# EAGLE design electron_layout_2 (EAGLE 8.5.1)

## Sheet 1 of 3
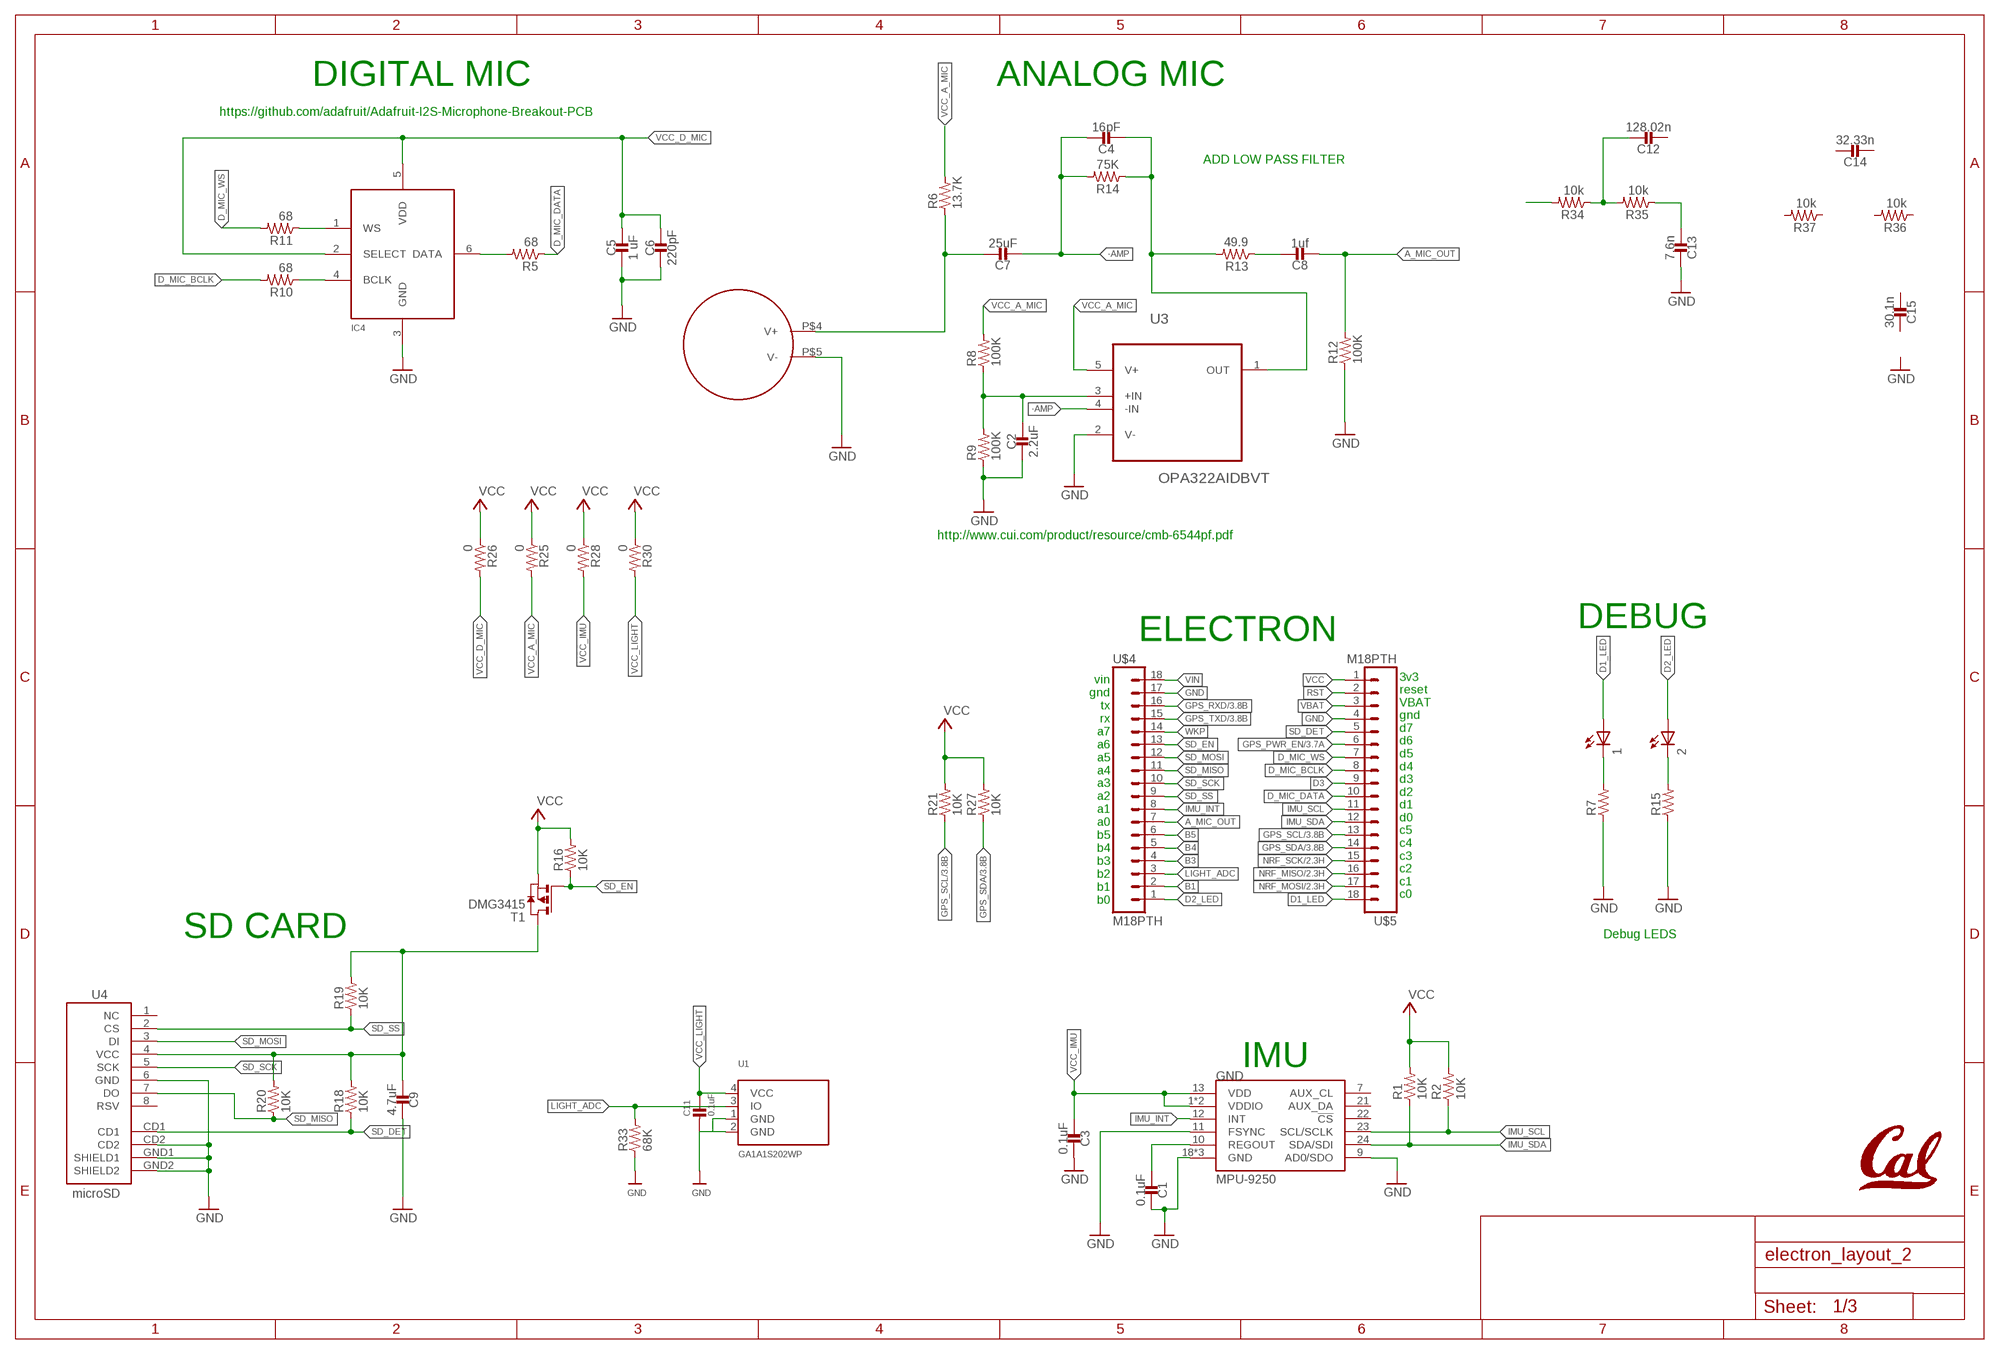
[diagram p0: schematic, sheet 1]

### Parts
1  LEDCHIP-LED0603  [CHIP-LED0603]
2  LEDCHIP-LED0603  [CHIP-LED0603]
C1  0.1uF  CAPACITOR0402_CAP  [0402_CAP]
C2  2.2uF  CAPACITOR0402_CAP  [0402_CAP]
C3  0.1uF  CAPACITOR0402_CAP  [0402_CAP]
C4  16pF  CAPACITOR0402_CAP  [0402_CAP]
C5  1 uF  CAPACITOR0402_CAP  [0402_CAP]
C6  220pF  CAPACITOR0402_CAP  [0402_CAP]
C7  25uF  CAPACITOR0402_CAP  [0402_CAP]
C8  1uf  CAPACITOR0402_CAP  [0402_CAP]
C9  4.7uF  CAPACITOR0402_CAP  [0402_CAP]
C11  0.1uF  CAP_CERAMIC_0805MP  [_0805MP]
C12  128.02n  CAPACITOR0402_CAP  [0402_CAP]
C13  7.6n  CAPACITOR0402_CAP  [0402_CAP]
C14  32.33n  CAPACITOR0402_CAP  [0402_CAP]
C15  30.1n  CAPACITOR0402_CAP  [0402_CAP]
GND  MPU-9250  [QFN24_PAD]
IC4  MIC_I2S_SPH0645  [SPH0645LM4H]
L1  UCB_CAL100MIL  [UCB_CAL_100MIL]
R1  10K  RESISTOR0402_RES  [0402_RES]
R2  10K  RESISTOR0402_RES  [0402_RES]
R5  68  RESISTOR0402_RES  [0402_RES]
R6  13.7K  RESISTOR0402_RES  [0402_RES]
R7  RESISTOR0402_RES  [0402_RES]
R8  100K  RESISTOR0402_RES  [0402_RES]
R9  100K  RESISTOR0402_RES  [0402_RES]
R10  68  RESISTOR0402_RES  [0402_RES]
R11  68  RESISTOR0402_RES  [0402_RES]
R12  100K  RESISTOR0402_RES  [0402_RES]
R13  49.9  RESISTOR0402_RES  [0402_RES]
R14  75K  RESISTOR0402_RES  [0402_RES]
R15  RESISTOR0402_RES  [0402_RES]
R16  10K  RESISTOR0402_RES  [0402_RES]
R18  10K  RESISTOR0402_RES  [0402_RES]
R19  10K  RESISTOR0402_RES  [0402_RES]
R20  10K  RESISTOR0402_RES  [0402_RES]
R21  10K  RESISTOR0402_RES  [0402_RES]
R25  0  RESISTOR0402_RES  [0402_RES]
R26  0  RESISTOR0402_RES  [0402_RES]
R27  10K  RESISTOR0402_RES  [0402_RES]
R28  0  RESISTOR0402_RES  [0402_RES]
R30  0  RESISTOR0402_RES  [0402_RES]
R33  68K  RESISTOR0402_RES  [0402_RES]
R34  10k  RESISTOR0402_RES  [0402_RES]
R35  10k  RESISTOR0402_RES  [0402_RES]
R36  10k  RESISTOR0402_RES  [0402_RES]
R37  10k  RESISTOR0402_RES  [0402_RES]
T1  DMG3415  PMOSSOT23  [SOT-23]
U1  GA1A1S202WP  [GA1A1S202WP]
U3  OPA322AIDBVT  [SOT95P280X145-5N]
U4  microSD  USD-SOCKETSMD  [MICRO-SD-SOCKET-PP]
U$1  CMB-6544PF  [CMB-6544PF]
U$4  M18PTH  [1X18-SMALL-PADS]
U$5  M18PTH  [1X18-SMALL-PADS]

### Nets
-AMP: C4.1 C7.2 R14.2 U3.4(-IN)
A_MIC_OUT: C8.2 R12.2 U$4.7
B1: U$4.2
B3: U$4.4
B4: U$4.5
B5: U$4.6
D1_LED: 1.A U$5.18
D2_LED: 2.A U$4.1
D3: U$5.9
D_MIC_BCLK: R10.2 U$5.8
D_MIC_DATA: R5.1 U$5.10
D_MIC_WS: R11.2 U$5.7
GND: C1.2 C2.2 C3.2 C5.2 C6.2 C9.2 C11.2 C13.1 GND.9(AD0/SDO) GND.11(FSYNC) GND.18(GND) GND.20(GND) GND.CENTER(GND) IC4.3(GND) R7.1 R9.1 R12.1 R15.1 R33.1 U1.1(GND) U1.2(GND) U3.2(V-) U4.6(GND) U4.CD2 U4.GND1(SHIELD1) U4.GND2(SHIELD2) U$1.P$5(V-) U$4.17 U$5.4 ; also sheet 2,3
GPS_PWR_EN: U$5.6 ; also sheet 3
GPS_RXD: U$4.16 ; also sheet 3
GPS_SCL: R21.1 U$5.13 ; also sheet 3
GPS_SDA: R27.1 U$5.14 ; also sheet 3
GPS_TXD: U$4.15 ; also sheet 3
IMU_INT: GND.12(INT) U$4.8
IMU_SCL: GND.23(SCL/SCLK) R2.1 U$5.11
IMU_SDA: GND.24(SDA/SDI) R1.1 U$5.12
LIGHT_ADC: R33.2 U1.3(IO) U$4.3
N$1: C7.1 R6.1 U$1.P$4(V+)
N$2: IC4.1(WS) R11.1
N$3: C4.2 R13.2 R14.1 U3.1(OUT)
N$4: IC4.4(BCLK) R10.1
N$5: 1.C R7.2
N$6: IC4.6(DATA) R5.2
N$7: C8.1 R13.1
N$8: 2.C R15.2
N$9: C2.1 R8.1 R9.2 U3.3(+IN)
N$10: C9.1 R18.2 R19.2 R20.2 T1.1(D) U4.4(VCC)
N$11: C12.1 R34.1 R35.2
N$12: C13.2 R35.1
N$13: R34.2
NRF_MISO: U$5.16 ; also sheet 2
NRF_MOSI: U$5.17 ; also sheet 2
NRF_SCK: U$5.15 ; also sheet 2
REGOUT: C1.1 GND.10(REGOUT)
RST: U$5.2
SD_DET: R18.1 U4.CD1 U$5.5
SD_EN: R16.1 T1.3(G) U$4.13
SD_MISO: R20.1 U4.7(DO) U$4.11
SD_MOSI: U4.3(DI) U$4.12
SD_SCK: U4.5(SCK) U$4.10
SD_SS: R19.1 U4.2(CS) U$4.9
VBAT: U$5.3
VCC: R1.2 R2.2 R21.2 R25.1 R26.1 R27.2 R28.1 R30.1 T1.2(S) U$5.1 ; also sheet 2,3
VCC_A_MIC: R6.2 R8.2 R25.2 U3.5(V+)
VCC_D_MIC: C5.1 C6.1 IC4.2(SELECT) IC4.5(VDD) R26.2
VCC_IMU: C3.1 GND.1(VDDIO) GND.8(VDDIO) GND.13(VDD) R28.2
VCC_LIGHT: C11.1 R30.2 U1.4(VCC)
VIN: U$4.18
WKP: U$4.14
Unconnected: C12.2 C14.1 C14.2 C15.1 C15.2 GND.7(AUX_CL) GND.21(AUX_DA) GND.22(!CS) R16.2 R36.1 R36.2 R37.1 R37.2 U4.1(NC) U4.8(RSV)

### Notes on the sheet
- DIGITAL MIC | ANALOG MIC
- https://github.com/adafruit/Adafruit-I2S-Microphone-Breakout-PCB
- ADD LOW PASS FILTER
- http://www.cui.com/product/resource/cmb-6544pf.pdf
- DEBUG
- ELECTRON
- vin
  gnd
  tx
  rx
  a7
  a6
  a5
  a4
  a3
  a2
  a1
  a0
  b5
  b4
  b3
  b2
  b1
  b0
- 3v3
  reset
  VBAT
  gnd
  d7
  d6
  d5
  d4
  d3
  d2
  d1
  d0
  c5
  c4
  c3
  c2
  c1
  c0
- SD CARD | Debug LEDS
- IMU

## Sheet 2 of 3: nRF51822
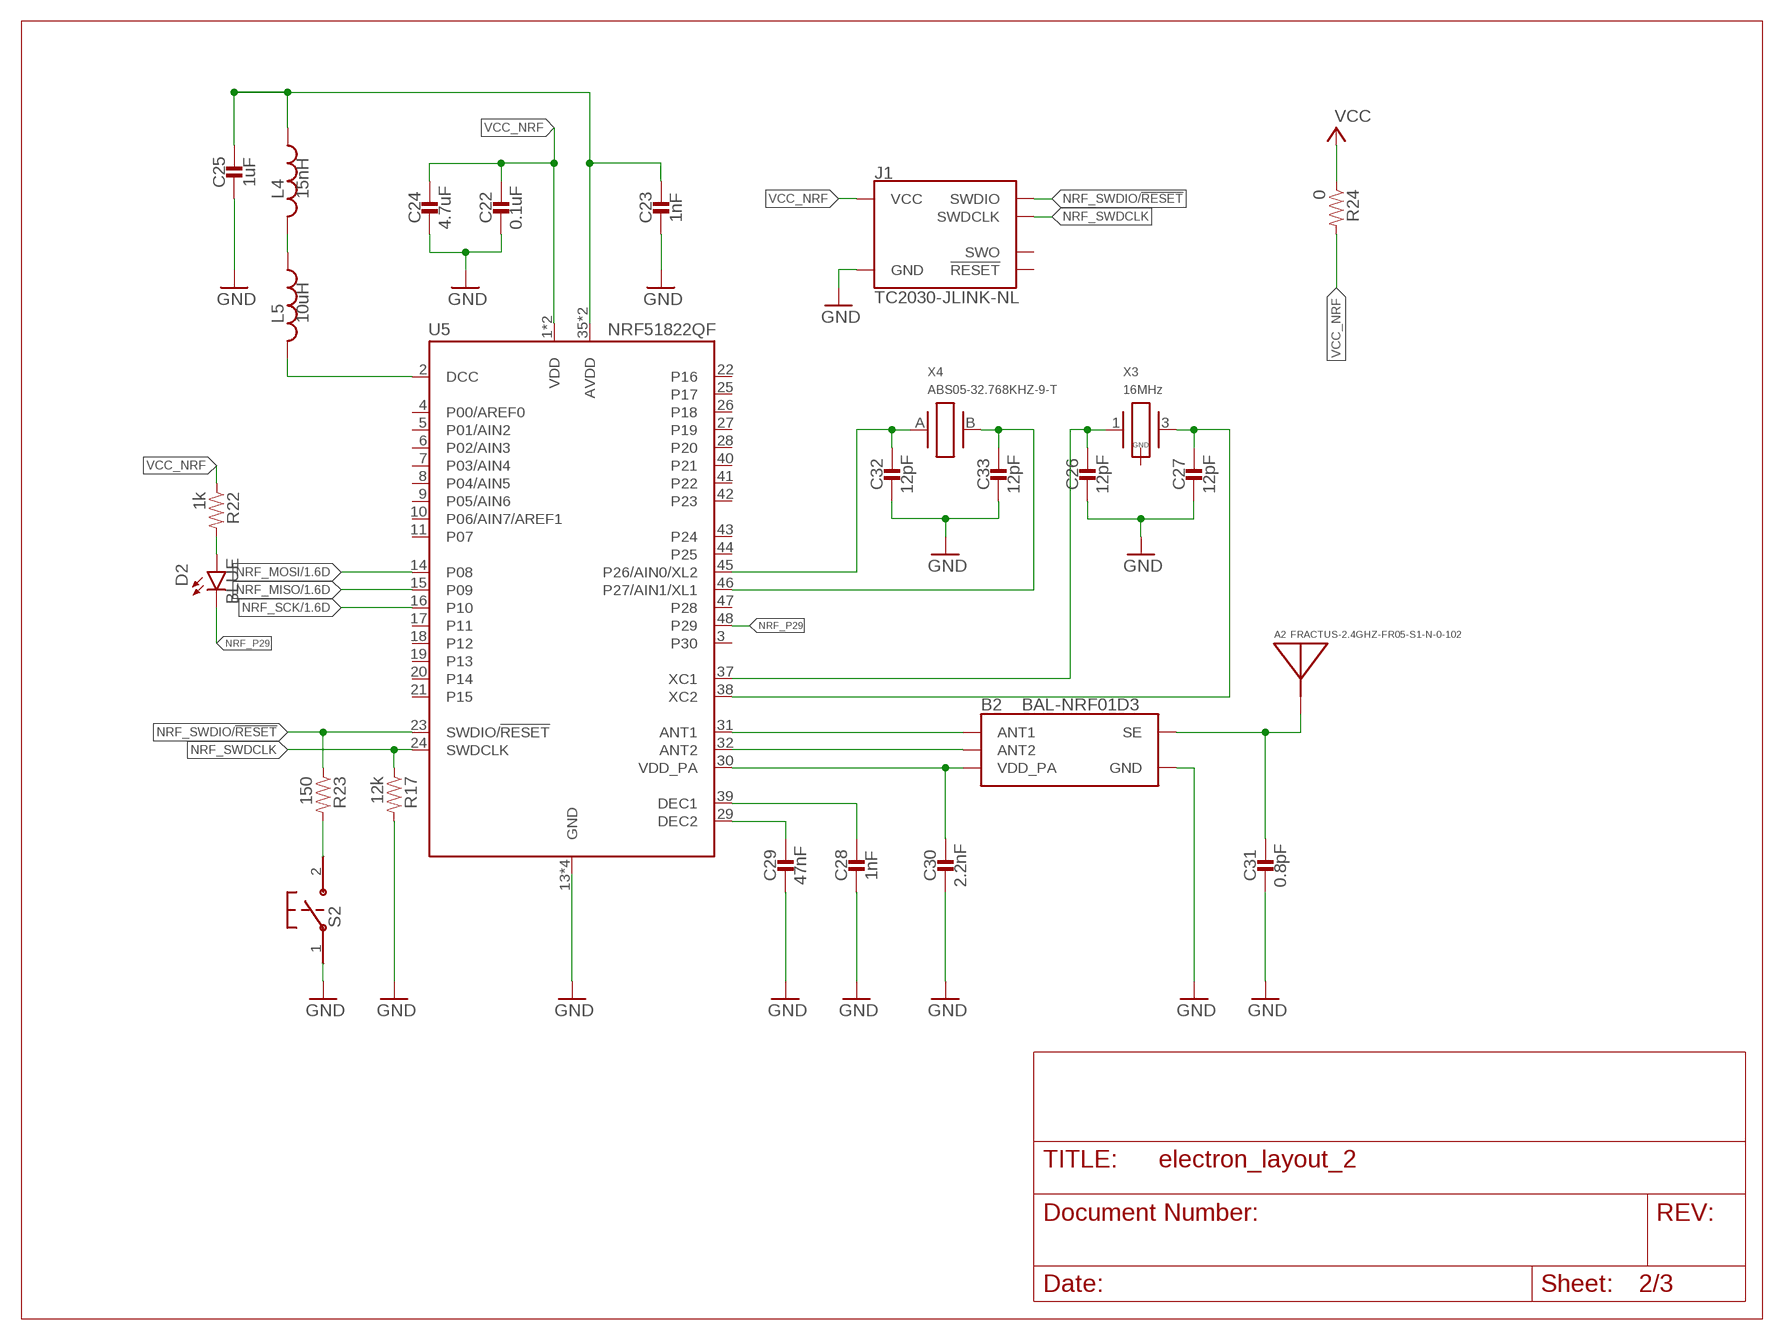
[diagram p1: schematic, sheet 2]

### Parts
A2  FRACTUS-2.4GHZ-FR05-S1-N-0-102  [FRACTUS-ANTENNA-FR05-S1-N-0-102]
B2  BAL-NRF01D3  [BAL-NRF01D3]
C22  0.1uF  CAPACITOR0402_CAP  [0402_CAP]
C23  1nF  CAPACITOR0402_CAP  [0402_CAP]
C24  4.7uF  CAPACITOR0402_CAP  [0402_CAP]
C25  1uF  CAPACITOR0402_CAP  [0402_CAP]
C26  12pF  CAPACITOR0402_CAP  [0402_CAP]
C27  12pF  CAPACITOR0402_CAP  [0402_CAP]
C28  1nF  CAPACITOR0402_CAP  [0402_CAP]
C29  47nF  CAPACITOR0402_CAP  [0402_CAP]
C30  2.2nF  CAPACITOR0402_CAP  [0402_CAP]
C31  0.8pF  CAPACITOR0402_CAP  [0402_CAP]
C32  12pF  CAPACITOR0402_CAP  [0402_CAP]
C33  12pF  CAPACITOR0402_CAP  [0402_CAP]
D2  BLUE  LED0603  [LED-0603]
J1  TC2030-JLINK-NL  [TC2030-IDC-NL]
L4  15nH  INDUCTOR0402  [0402_CAP]
L5  10uH  INDUCTOR0603  [0603_CAP]
R17  12k  RESISTOR0402_RES  [0402_RES]
R22  1k  RESISTOR0402_RES  [0402_RES]
R23  150  RESISTOR0402_RES  [0402_RES]
R24  0  RESISTOR0402_RES  [0402_RES]
S2  B3U-1000P  [B3U-1000P]
U5  NRF51822QF  [QFN-48-6MM]
X3  16MHz  TXC-8Y  [TXC-8Y]
X4  ABS05-32.768KHZ-9-T  [ABS05]

### Nets
AVDD1: C23.1 C25.1 L4.1 U5.35(AVDD) U5.36(AVDD)
DCC1: L5.2 U5.2(DCC)
GND: B2.GND C22.2 C23.2 C24.2 C25.2 C26.2 C27.2 C28.2 C29.2 C30.2 C31.2 C32.2 C33.2 J1.5(GND) R17.2 S2.1 U5.13(GND) U5.33(GND) U5.34(GND) U5.GND ; also sheet 1,3
N$24: B2.ANT1 U5.31(ANT1)
N$25: B2.ANT2 U5.32(ANT2)
N$26: A2.1(ANTENNA) B2.SE C31.1
N$27: L4.2 L5.1
N$28: C26.1 U5.37(XC1) X3.1
N$29: C27.1 U5.38(XC2) X3.3
N$30: C28.1 U5.39(DEC1)
N$31: C29.1 U5.29(DEC2)
N$32: D2.A R22.2
N$33: R23.2 S2.2
NRF_A2: C33.1 U5.46(P27/AIN1/XL1) X4.B
NRF_A3: C32.1 U5.45(P26/AIN0/XL2) X4.A
NRF_MISO: U5.15(P09) ; also sheet 1
NRF_MOSI: U5.14(P08) ; also sheet 1
NRF_P29: D2.C U5.48(P29)
NRF_SCK: U5.16(P10) ; also sheet 1
NRF_SWDCLK: J1.4(SWDCLK) R17.1 U5.24(SWDCLK)
NRF_SWDIO/!RESET: J1.2(SWDIO) R23.1 U5.23(SWDIO/!RESET)
VCC: R24.1 ; also sheet 1,3
VCC_NRF: C22.1 C24.1 J1.1(VCC) R22.1 R24.2 U5.1(VDD) U5.12(VDD)
VDD_PA1: B2.VCC(VDD_PA) C30.1 U5.30(VDD_PA)
Unconnected: J1.3(!RESET) J1.6(SWO) U5.3(P30) U5.4(P00/AREF0) U5.5(P01/AIN2) U5.6(P02/AIN3) U5.7(P03/AIN4) U5.8(P04/AIN5) U5.9(P05/AIN6) U5.10(P06/AIN7/AREF1) U5.11(P07) U5.17(P11) U5.18(P12) U5.19(P13) U5.20(P14) U5.21(P15) U5.22(P16) U5.25(P17) U5.26(P18) U5.27(P19) U5.28(P20) U5.40(P21) U5.41(P22) U5.42(P23) U5.43(P24) U5.44(P25) U5.47(P28) X3.2(GND) X3.4(GND)

## Sheet 3 of 3
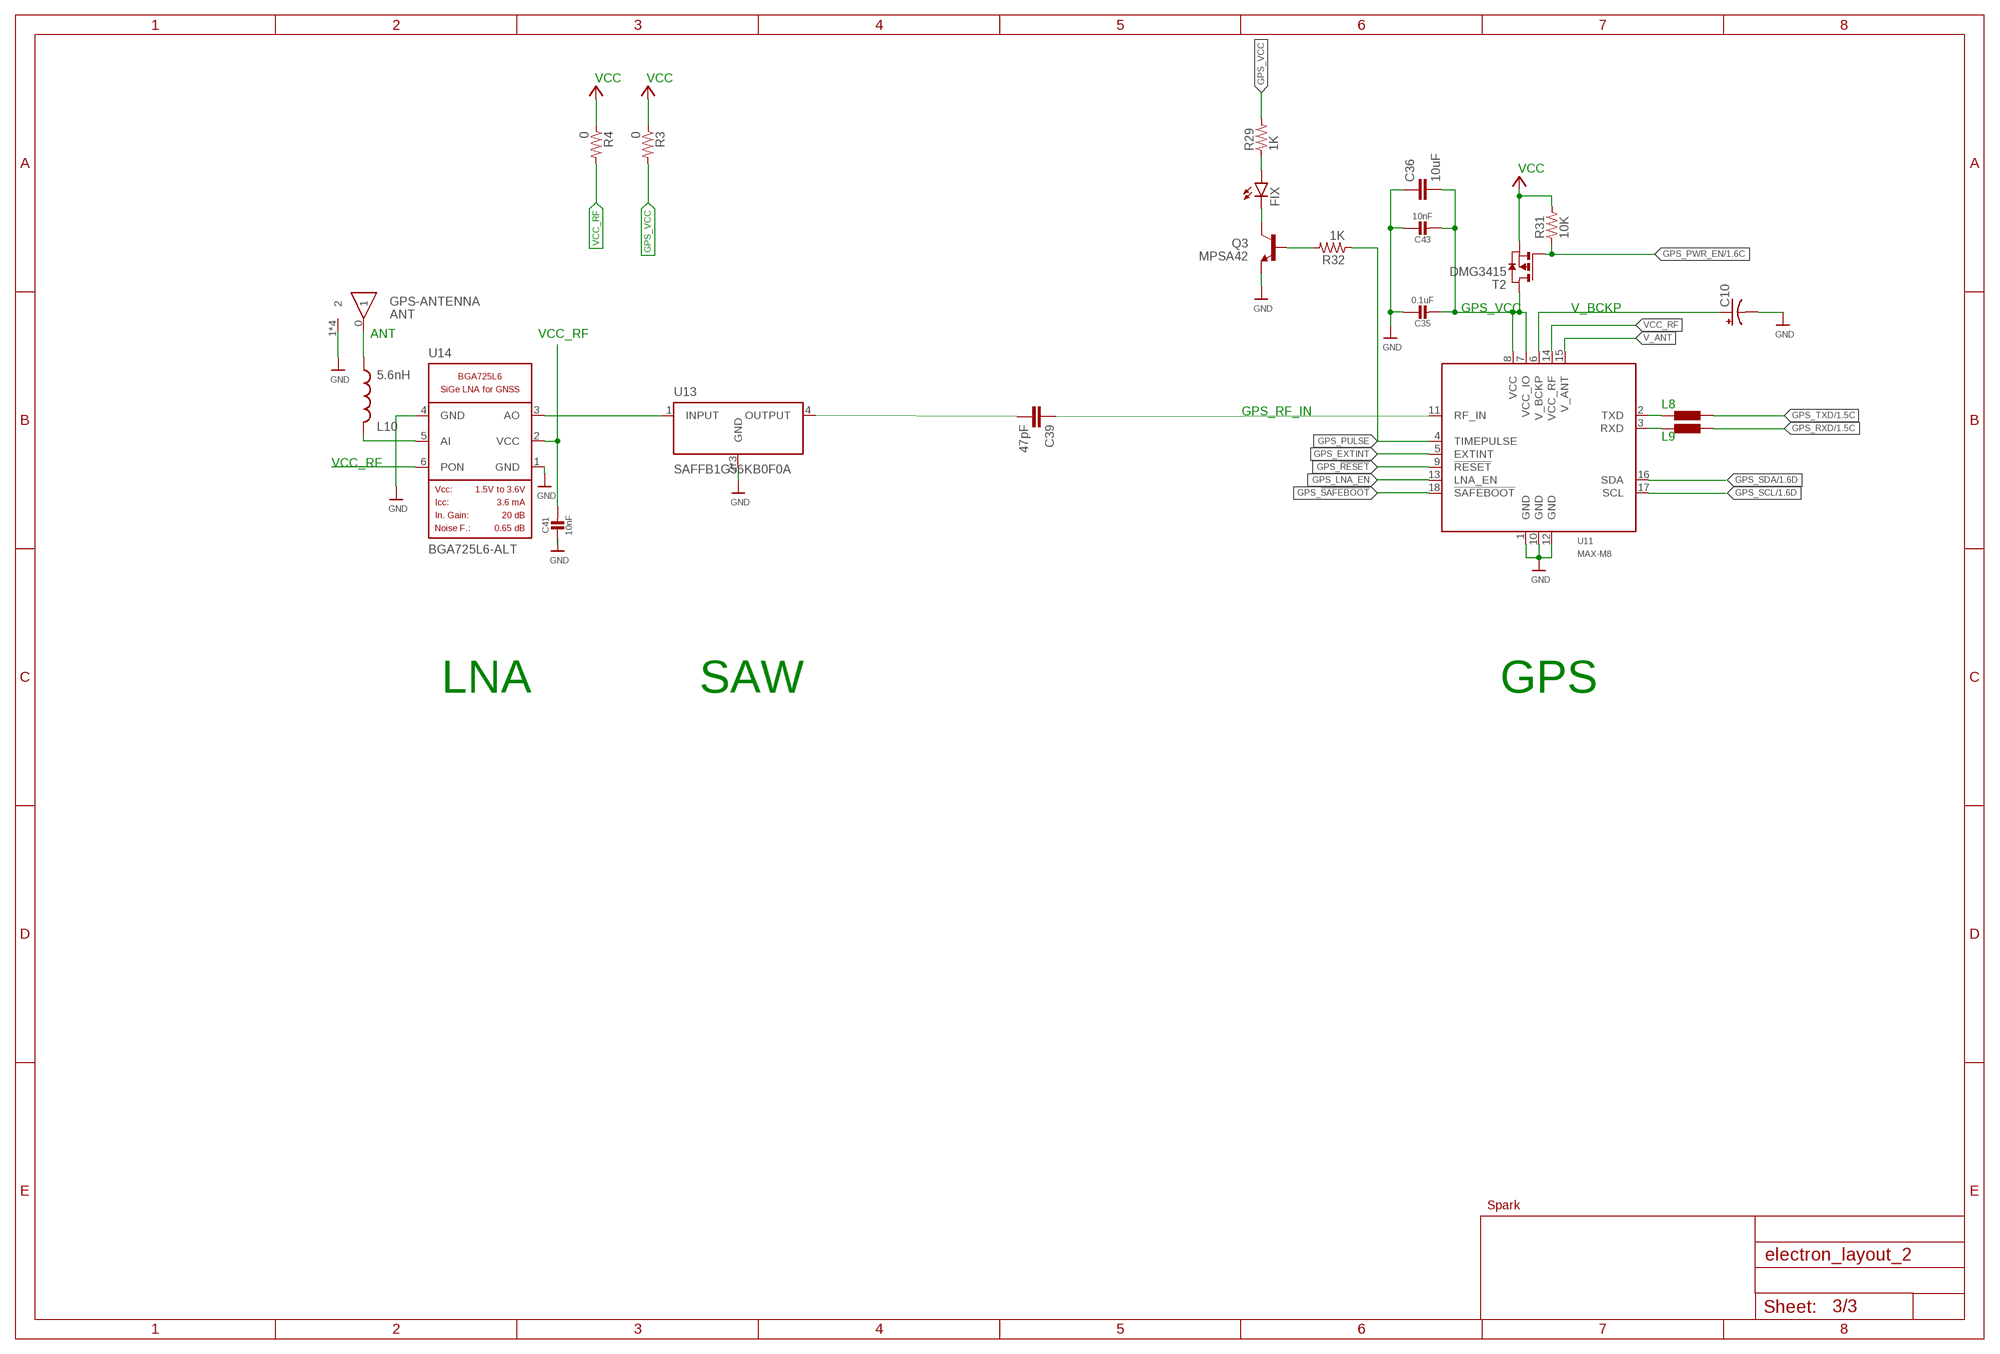
[diagram p2: schematic, sheet 3]

### Parts
ANT  GPS-ANTENNA  [ANT1818B00BT1516S]
C10  SUPERCAP  [414-VA5R]
C35  0.1uF  CAP_CERAMIC_0402MP  [_0402MP]
C36  10uF  C-EUC0402  [C0402]
C39  47pF  C-EUC0201  [C0201]
C41  10nF  CAP_CERAMIC_0402MP  [_0402MP]
C43  10nF  CAP_CERAMIC_0402MP  [_0402MP]
FIX  LED0603  [LED-0603]
L8  BLM15H2  [_0402MP]
L9  BLM15H2  [_0402MP]
L10  5.6nH  INDUCTOR0402  [C0402]
Q3  MPSA42  TRANSISTOR_NPNMPSA42  [SOT23-3]
R3  0  RESISTOR0402_RES  [0402_RES]
R4  0  RESISTOR0402_RES  [0402_RES]
R29  1K  RESISTOR0402_RES  [0402_RES]
R31  10K  RESISTOR0402_RES  [0402_RES]
R32  1K  RESISTOR0402_RES  [0402_RES]
T2  DMG3415  PMOSSOT23  [SOT-23]
U11  MAX-M8  [MAX-M8]
U13  SAFFB1G56KB0F0A  FILTERS  [QCS5I]
U14  BGA725L6-ALT  [LNA-TSLP-6-2-ALT]
U$69  SPARK_LOGO  [SPARK_LOGO_TSTOP]

### Nets
ANT: ANT.0 L10.2
GND: ANT.1 ANT.2 ANT.3 ANT.4 C10.- C35.1 C36.1 C41.1 C43.1 Q3.2(E) U11.1(GND) U11.10(GND) U11.12(GND) U13.2(GND) U13.3(GND) U13.5(GND) U14.1(GND) U14.4(GND) ; also sheet 1,2
GPS_!RESET: U11.9(!RESET)
GPS_!SAFEBOOT: U11.18(!SAFEBOOT)
GPS_EXTINT: U11.5(EXTINT)
GPS_LNA_EN: U11.13(LNA_EN)
GPS_PULSE: R32.1 U11.4(TIMEPULSE)
GPS_PWR_EN: R31.1 ; also sheet 1
GPS_RF_IN: C39.1 U11.11(RF_IN)
GPS_RXD: L9.2 ; also sheet 1
GPS_SCL: U11.17(SCL) ; also sheet 1
GPS_SDA: U11.16(SDA) ; also sheet 1
GPS_TXD: L8.2 ; also sheet 1
GPS_VCC: C35.2 C36.2 C43.2 R3.2 R29.2 T2.1(D) U11.7(VCC_IO) U11.8(VCC)
LNA_IN1: L10.1 U14.5(AI)
LNA_OUT1: U13.1(INPUT) U14.3(AO)
N$23: Q3.1(B) R32.2
N$42: FIX.C Q3.3(C)
N$43: FIX.A R29.1
N$44: L8.1 U11.2(TXD)
N$45: L9.1 U11.3(RXD)
SAW_OUT1: C39.2 U13.4(OUTPUT)
V_ANT: U11.15(V_ANT)
V_BCKP: C10.+ U11.6(V_BCKP)
VCC: R3.1 R4.1 R31.2 T2.2(S) ; also sheet 1,2
VCC_RF: C41.2 R4.2 U11.14(VCC_RF) U14.2(VCC) U14.6(PON)
Unconnected: T2.3(G)

### Notes on the sheet
- LNA | SAW | GPS

## Library data of the parts
1 2 = adafruit:LED: LED OSRAM: - CHIPLED LG R971, LG N971, LY N971, LG Q971, LY Q971, LO R971, LY R971 LH N974, LH R974 LS Q976, LO Q976, LY Q976 LO Q996 - Hyper CHIPLED LW Q18S LB Q993, LB Q99A, LB R99A - SideLED LS A670, LO A670, LY A670, LG A670, LP A670 LB A673, LV A673, LT A673, LW A673 LH A674 LY A675 LS A676, LA A676, LO A676, LY A676, LW A676 LS A679, LY A679, LG A679 - Hyper Micro SIDELED® LS Y876, LA Y876, LO Y876, LY Y876 LT Y87S - SmartLED LW L88C, LW L88S LB L89C, LB L89S, LG L890 LS L89K, LO L89K, LY L89K LS L896, LA L896, LO L896, LY L896 - TOPLED LS T670, LO T670, LY T670, LG T670, LP T670 LSG T670, LSP T670, LSY T670, LOP T670, LYG T670 LG T671, LOG T671, LSG T671 LB T673, LV T673, LT T673, LW T673 LH T674 LS T676, LA T676, LO T676, LY T676, LB T676, LH T676, LSB T676, LW T676 LB T67C, LV T67C, LT T67C, LS T67K, LO T67K, LY T67K, LW E67C LS E67B, LA E67B, LO E67B, LY E67B, LB E67C, LV E67C, LT E67C LW T67C LS T679, LY T679, LG T679 LS T770, LO T770, LY T770, LG T770, LP T770 LB T773, LV T773, LT T773, LW T773 LH T774 LS E675, LA E675, LY E675, LS T675 LS T776, LA T776, LO T776, LY T776, LB T776 LHGB T686 LT T68C, LB T68C - Hyper Mini TOPLED® LB M676 - Mini TOPLED Santana® LG M470 LS M47K, LO M47K, LY M47K Source: http://www.osram.convergy.de/
A2 = chips:FRACTUS-2.4GHZ-FR05-S1-N-0-102: Fractus Compact Reach XtendTM chip antenna is engineered specifically for Bluetooth, WLAN 802.11 b/g/n and other wireless devices operating at the ISM 2.4 GHz band. Compact Reach Xtend combines small form factor size and high performance to improve the functionality of your wireless devices.; RICHARDSON_RFPD: FR05-S1-N-0102B
ANT = antenna:GPS-ANTENNA
B2 = chips:BAL-NRF01D3: 50 ohm nominal input / conjugate match balun to nRF51422-QFAA, nRF24LE1, nRF51822-QFAA/AB, with integrated harmonic filter; DIGIKEY: 497-13637-1-ND; MOUSER: 511-BAL-NRF01D3
C1-C9 C12-C15 = passives:CAPACITOR: SMD Capacitor
C10 = adafruit:SUPERCAP
C11 = microbuilder:CAP_CERAMIC: Ceramic Capacitors
C22 = passives:CAPACITOR: SMD Capacitor; DIGIKEY: 445-4952-1-ND
C23 C28 = passives:CAPACITOR: SMD Capacitor; DIGIKEY: 490-1303-1-ND
C24 = passives:CAPACITOR: SMD Capacitor; DIGIKEY: 445-5947-1-ND
C25 = passives:CAPACITOR: SMD Capacitor; DIGIKEY: 1276-1513-1-ND
C26 C27 C32 C33 = passives:CAPACITOR: SMD Capacitor; DIGIKEY: 490-6197-1-ND
C29 = passives:CAPACITOR: SMD Capacitor; DIGIKEY: 445-1264-1-ND
C30 = passives:CAPACITOR: SMD Capacitor; DIGIKEY: 490-5419-1-ND
C31 = passives:CAPACITOR: SMD Capacitor; DIGIKEY: 490-6269-1-ND
C35 C41 C43 = asset-tracker-v008:CAP_CERAMIC: Ceramic Capacitors
C36 C39 = rcl:C-EU: CAPACITOR, European symbol
D2 FIX = SparkFun-LED:LED: LEDs Standard schematic elements and footprints for 5mm, 3mm, 1206, and 0603 sized LEDs. 5mm - Spark Fun Electronics SKU : COM-00529 (and others)
GND = Testing:MPU-9250: NC pin 19. 2-6 & 14-17 not internally connected. May be used for PCB trace routing.; PROD_ID: IC-13192
IC4 = microbuilder:MIC_I2S
J1 = connector:TC2030-JLINK
L1 = logos:UCB_CAL
L4 = passives:INDUCTOR: A very specific inductor; DIGIKEY: 587-1521-1-ND
L5 = passives:INDUCTOR: A very specific inductor; DIGIKEY: 490-4025-1-ND
L8 L9 = asset-tracker-v008:BLM15H: EMIFIL (R) Chip Ferrite Bead for GHz Noise Source: http://www.murata.com/ Ferrite Bead BLM15H.pdf
L10 = SparkFun-Passives:INDUCTOR: Inductors Basic Inductor/Choke - 0603 and 1206. Footprints are not proven and vary greatly between part numbers. INDUCTOR POWER 3.3UH 4.0A SMD 0.197" L x 0.197" W x 0.177" H (5.00mm x 5.00mm x 4.50mm)
Q3 = SparkFun-DiscreteSemi:TRANSISTOR_NPN: Generic NPN BJT MMBT2222A - TRANS-08049 (SOT-23, 1A 40V) MPSA42 - TRANS-09116 (SOT-23, 500mA 300V) MMBT5088LT1G - TRANS-11160 (SOT-23, 50 mA 30V) BC547 - COM-08928 <http://www.sparkfun.com/products/8928> (TO-92 45V 100mA) (1.Collector 2.Base 3.Emitter) 2N3904 - COM-00521 <http://www.sparkfun.com/products/521> (TO-92 40V 200mA) (1.Emitter 2.Base 3.Collector) P2N2222A - COM-12852 <http://www.sparkfun.com/products/12852> (TO-92 40V 600mA) (1.Collector 2.Base 3.Emitter); PROD_ID: TRANS-09116
R1-R16 R18-R21 R24-R37 = passives:RESISTOR: Resistor Basic schematic elements and footprints for 0603, 1206, and PTH resistors.
R17 = passives:RESISTOR: Resistor Basic schematic elements and footprints for 0603, 1206, and PTH resistors.; DIGIKEY: RHM12.0KCDCT-ND
R22 = passives:RESISTOR: Resistor Basic schematic elements and footprints for 0603, 1206, and PTH resistors.; DIGIKEY: RHM1.0KCECT-ND
R23 = passives:RESISTOR: Resistor Basic schematic elements and footprints for 0603, 1206, and PTH resistors.; DIGIKEY: RHM150CDCT-ND
S2 = switches:B3U: Switch; DIGIKEY: SW1020CT-ND
T1 T2 = zetex:PMOSSOT23: MOS FET; OC_FARNELL: unknown; OC_NEWARK: unknown
U1 = microbuilder:GA1A1S202WP: GA1A1S202WP - Analog Light Sensor Technical Specifications: VCC: 2.3-3.2V Operating Temperature: -40°C to 85°C Dynamic Range: 3-55000 lux Peak Sensitivty: 555 nm Digikey: 425-2789-1-ND Mouser: 852-GA1A1S202WP
U3 = OPA322AIDBVT:OPA322AIDBVT: Operational Amplifier; AVAILABILITY: Good; DESCRIPTION: 20MHz, Low Noise, 1.8V RRIO, CMOS Operational Amplifier with Shutdown 5-SOT-23 -40 to 125; MF: Texas Instruments; MP: OPA322AIDBVT; PACKAGE: SOT-23 Texas Instruments; PRICE: 1.26 USD
U4 = SparkFun:USD-SOCKET: microSD Socket Push-push type uSD socket. Schematic element and footprint production proven. Spark Fun Electronics SKU : PRT-00127. tDoc lines correctly indicate media card edge positions when inserting (unlocked, locked, depressed).
U5 = chips:NRF51822: Multiprotocol Bluetooth® 4.0 low energy/2.4 GHz RF SoC; DIGIKEY: 1490-1049-1-ND; MOUSER: 949-NRF51822-QFAC-R7
U11 = u-blox:MAX-M8
U13 = Particle:FILTERS
U14 = Particle:BGA725L6
U$1 = microphone:CMB-6544PF: 20HZ-20KHZ Electret Condenser Microphone https://www.digikey.com/en/ptm/c/cui-inc/electret-condenser-microphones?pn_sku=102-1722-ND&part_id=1869982
U$4 U$5 = Particle:M18
U$69 = Spark:SPARK_LOGO
X3 = crystals:TXC-8Y: 2mmx1.6mm SMD Crystal; DIGIKEY: 887-2003-1-ND
X4 = crystals:ABS05-32.768KHZ: 32.768kHz Crystal; DIGIKEY: 535-11897-1-ND

## Board
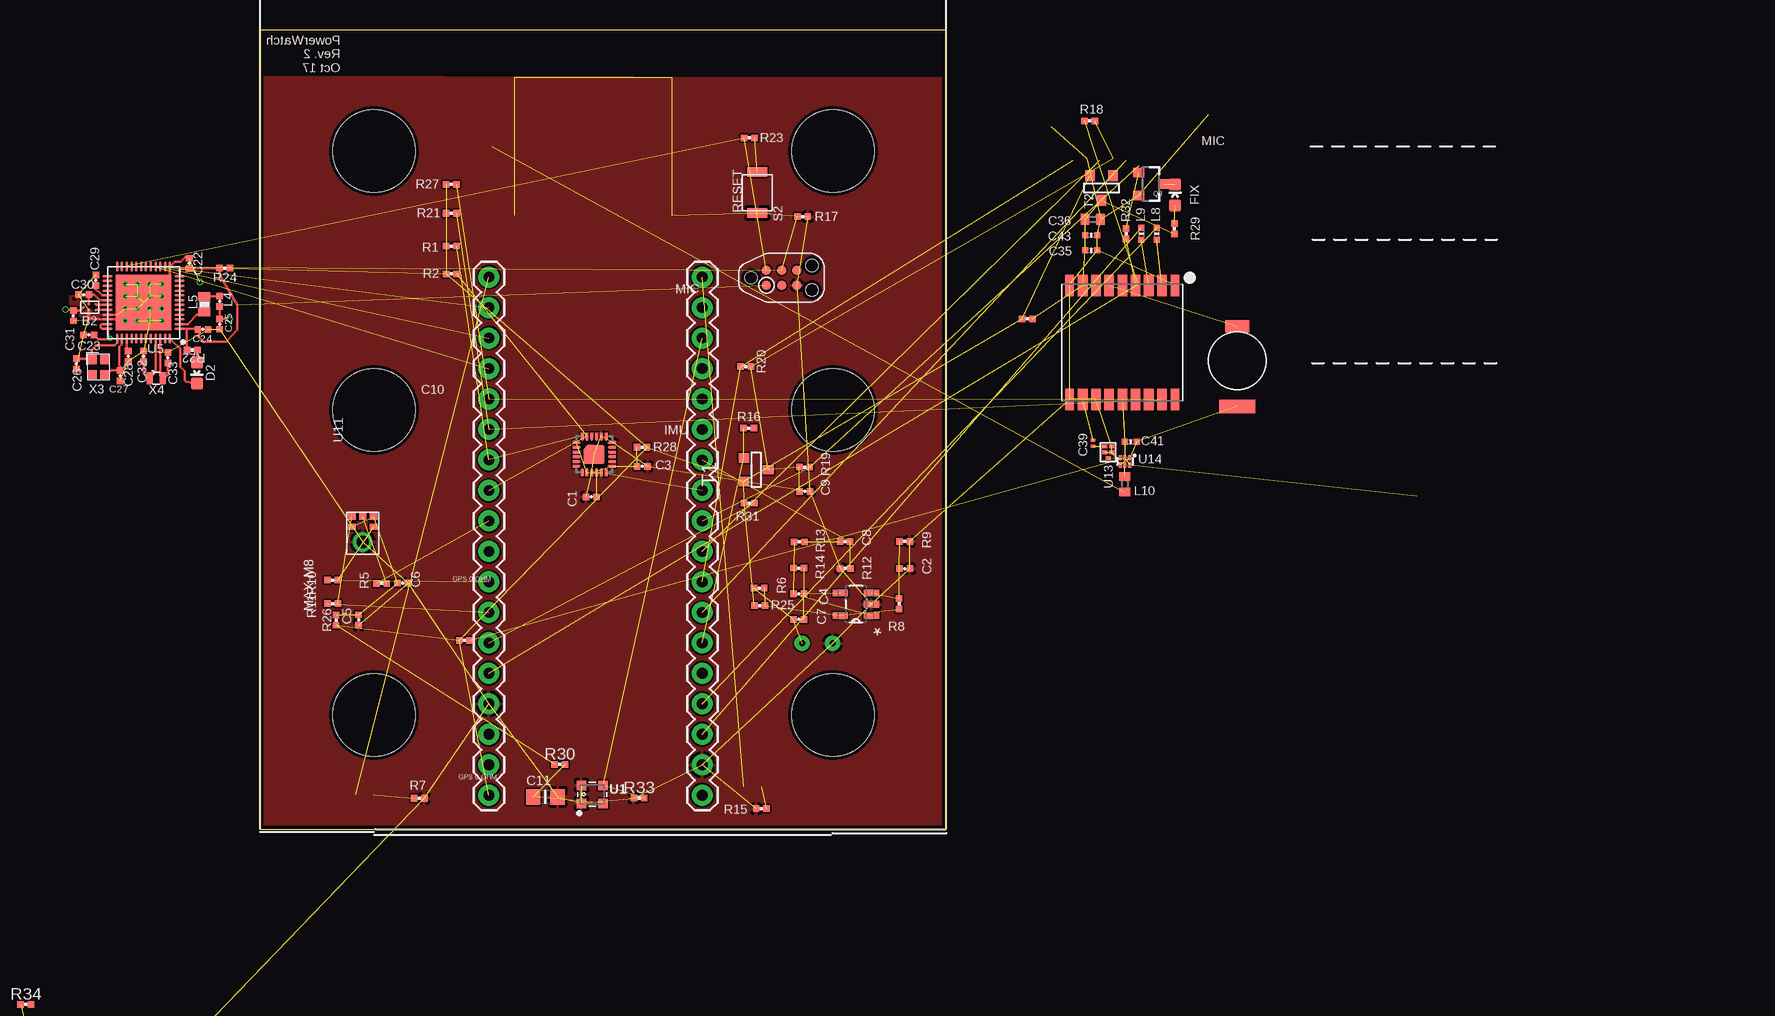
[diagram p3: board, top side]
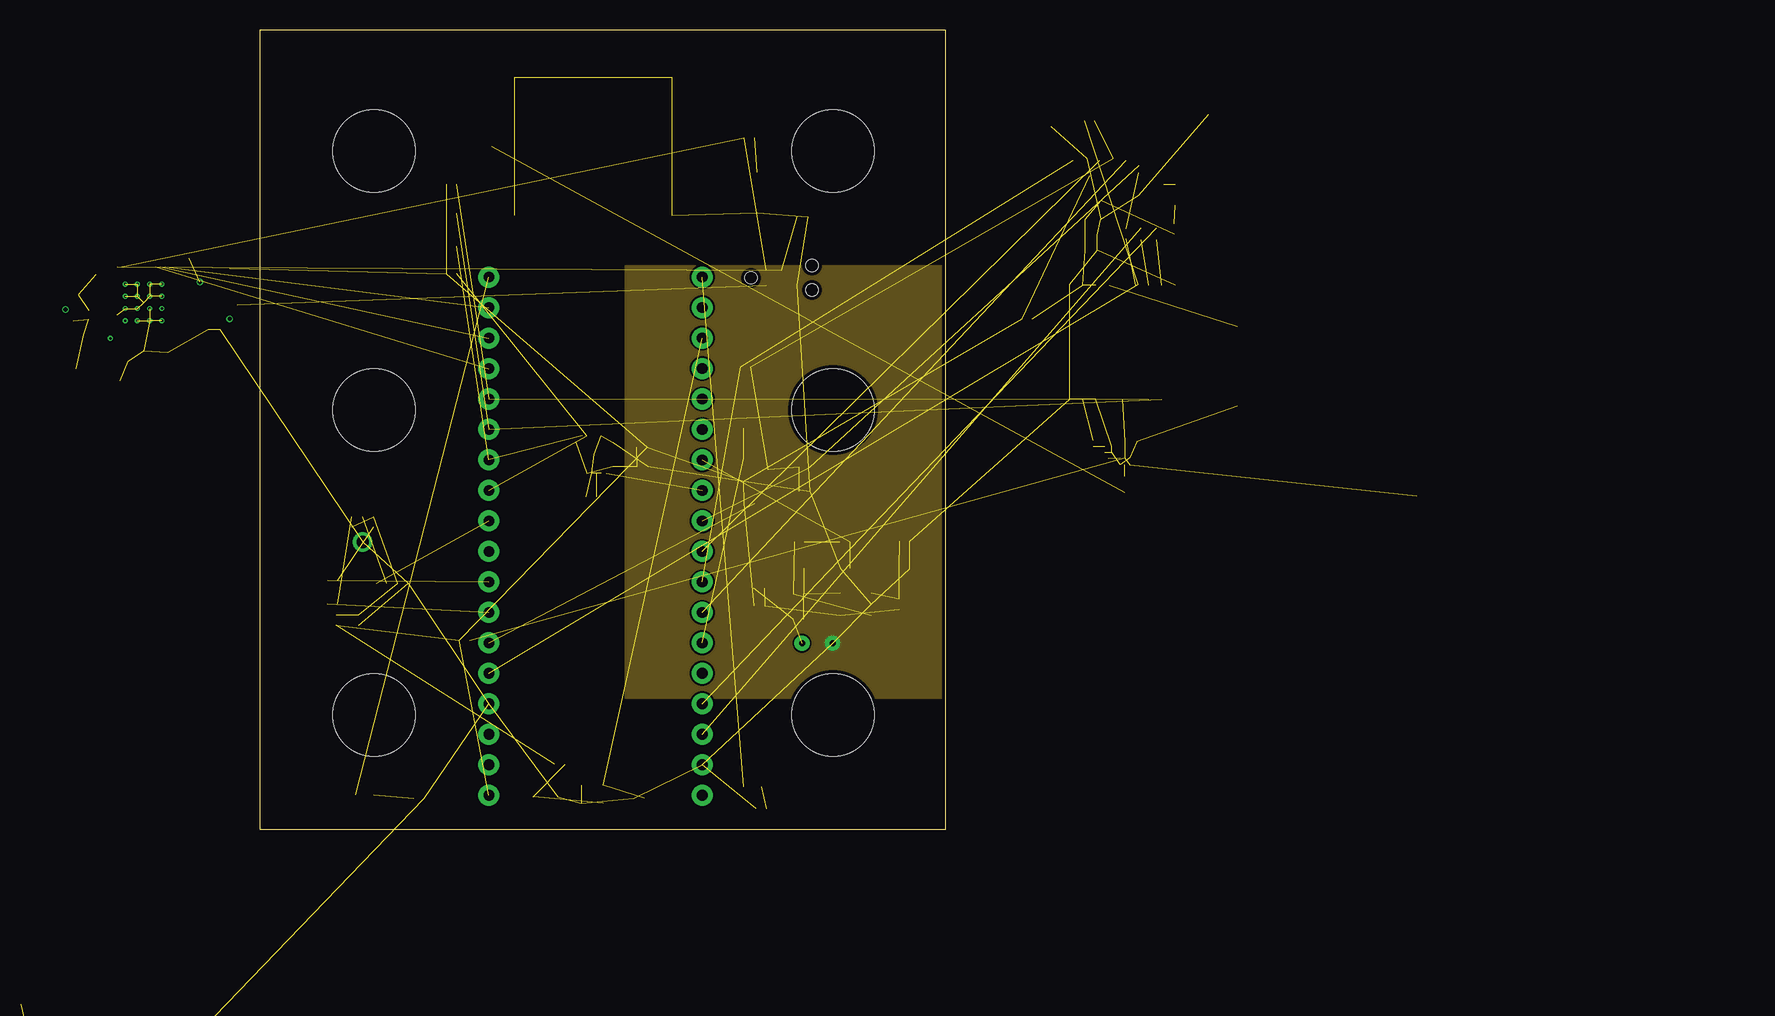
[diagram p4: board, inner layer Route2]
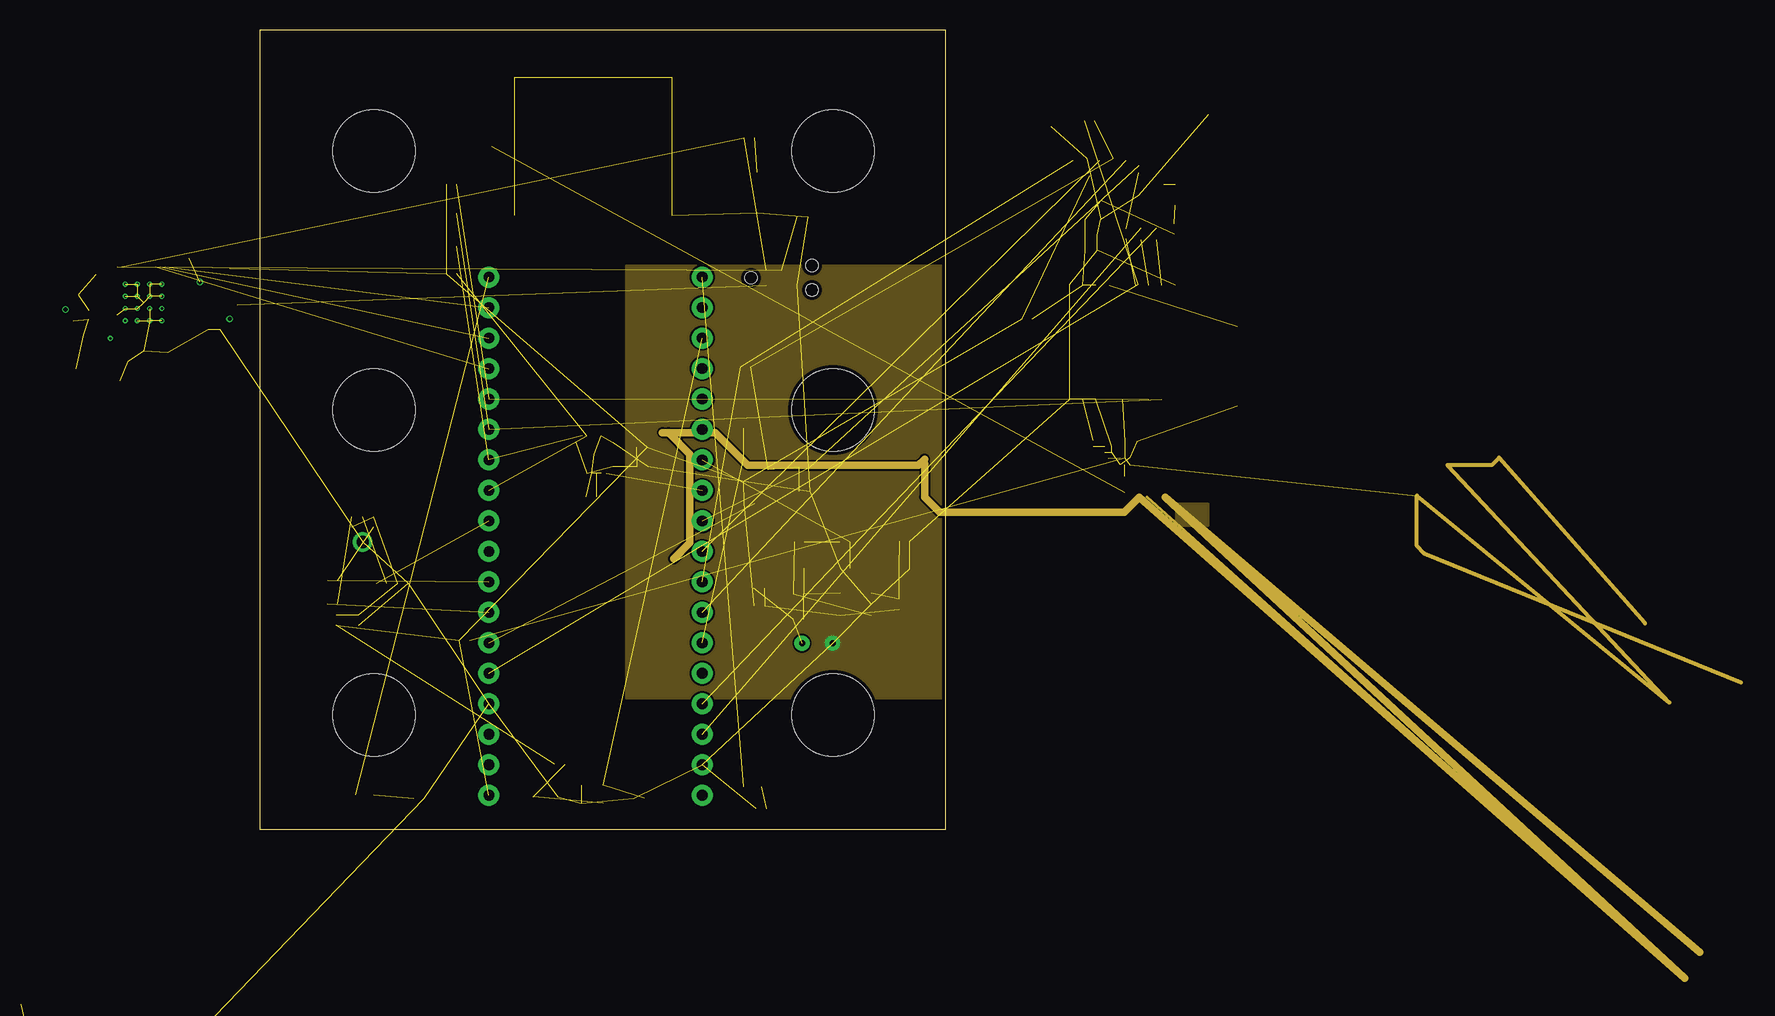
[diagram p5: board, inner layer Route15]
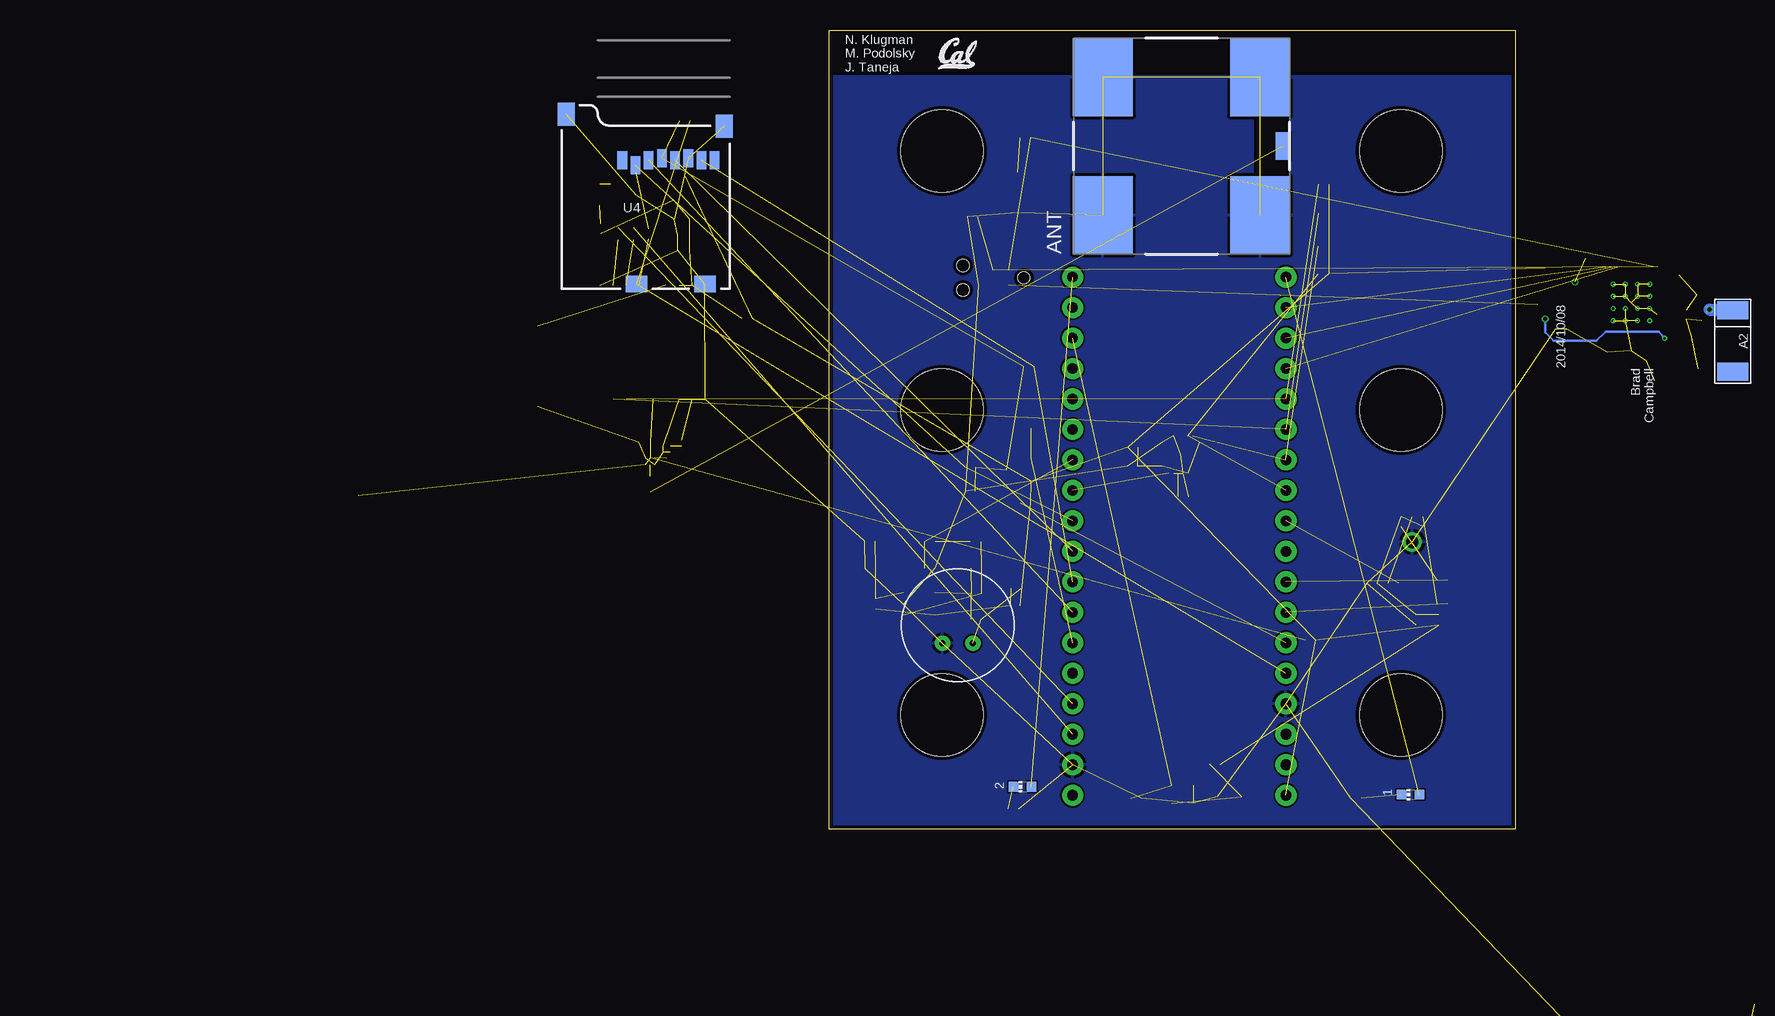
[diagram p6: board, bottom side, seen from below]

Size 57.15 x 66.6 mm. Coordinates in mm from the lower left corner, seen from the top.
Outline: 0,0 57.15,0 57.15,66.6 0,66.6 0,0
Copper layers (1*16): Top 0.0178mm / dielectric 59mil / Bottom 0.0178mm
Design rules "quickturn_co_kr_1oz": minimum track width 4mil, minimum drill 0.200659375mm, track to track 6mil, track to pad 6mil, pad to pad 6mil, via to via 6mil, smd to smd 6mil, copper to edge 12mil, drill to drill 12mil, minimum pad ring 8mil, minimum via ring 4mil, stop-mask expansion 3mil, vias tented up to drill 50mil, thermal gap 10mil
Holes 6.86 mm at 47.75,9.53 9.53,9.53 9.53,81.92 47.75,81.92 9.53,56.52 9.53,34.92 47.75,56.52 47.75,34.92

### Footprints (pad centres in the part's own frame; a part is rotated, then mirrored left to right if it is on the bottom)
CHIP-LED0603 = smd 0.8 x 0.8: A 0,-0.75; C 0,0.75
FRACTUS-ANTENNA-FR05-S1-N-0-102 = smd 1.5 x 2.6: 1 -2.55,0; 2 2.55,0
ANT1818B00BT1516S = smd 2.3 x 1.2: 0 0,-8.45 | smd 6.5 x 5: 1 -5.75,-6.55; 2 5.75,-6.55; 3 5.75,6.55; 4 -5.75,6.55
BAL-NRF01D3 = smd 0.22 x 0.22: ANT1 -0.517,-0.25; ANT2 -0.517,0.25; GND 0.083,0.25; SE 0.516,0; VCC 0.083,-0.25
0402_CAP = smd 0.536 x 0.546: 1 -0.433,0; 2 0.433,0
414-VA5R = smd 1 x 2: + -2.9,0 | smd 1.1 x 3: - 3.8,0
_0805MP = smd 1.2 x 1.3: 1 -1.016,0; 2 1.016,0
_0402MP = smd 0.5 x 0.5: 1 -0.508,0; 2 0.508,0
C0402 = smd 0.7 x 0.9: 1 -0.65,0; 2 0.65,0
C0201 = smd 0.25 x 0.35: 1 -0.25,0; 2 0.25,0
LED-0603 = smd 1 x 1: A 0,-0.877; C 0,0.877
QFN24_PAD = smd 0.5 x 0.25: 1 -1.55,1; 2 -1.55,0.6; 3 -1.55,0.2; 4 -1.55,-0.2; 5 -1.55,-0.6; 6 -1.55,-1; 13 1.55,-1; 14 1.55,-0.6; 15 1.55,-0.2; 16 1.55,0.2; 17 1.55,0.6; 18 1.55,1 | smd 0.08 x 0.13: 1$1 -1.32,1.06; 1$3 -1.26,0.94; P$33 1.26,-0.94; P$34 1.32,-1.06; P$58 1.26,0.94; P$59 1.32,1.06; P$68 -1.26,-0.94; P$69 -1.32,-1.06 | smd 0.1 x 0.185 rotated 45: 1$2 -1.25,1.024; P$49 1.024,-1.25 | smd 0.14 x 0.14: 1$4 -1.22,0.945; P$23 -0.945,-1.22; P$24 1.22,-0.945; P$36 0.945,1.22; P$51 0.945,-1.22; P$56 1.22,0.945; P$61 -0.945,1.22; P$66 -1.22,-0.945 | smd 0.05 x 0.05: 1$5 -1.175,0.97; P$25 -0.97,-1.175; P$31 1.175,-0.97; P$37 0.97,1.175; P$52 0.97,-1.175; P$57 1.175,0.97; P$62 -0.97,1.175; P$67 -1.175,-0.97 | smd 0.25 x 0.5: 7 -1,-1.55; 8 -0.6,-1.55; 9 -0.2,-1.55; 10 0.2,-1.55; 11 0.6,-1.55; 12 1,-1.55; 19 1,1.55; 20 0.6,1.55; 21 0.2,1.55; 22 -0.2,1.55; 23 -0.6,1.55; 24 -1,1.55 | smd 0.25 x 0.25: CENTER 0,0 | smd 0.4 x 0.4: DBBADFE -0.675,0.24 | smd 0.6 x 1.2: DBBADFE1 -0.575,-0.195 | smd 0.25 x 0.3: P$1 -0.2,1.3; P$3 0.2,1.3; P$5 0.6,1.3; P$11 -0.6,1.3; P$16 0.2,-1.3; P$18 -0.2,-1.3; P$20 -0.6,-1.3; P$26 0.6,-1.3 | smd 0.3 x 0.25: P$2 -1.3,0.2; P$4 -1.3,0.6; P$28 -1.3,-0.2; P$38 -1.3,-0.6; P$40 1.3,0.2; P$42 1.3,-0.2; P$44 1.3,-0.6; P$50 1.3,0.6 | smd 0.1 x 0.185 rotated 225: P$7 1.25,-1.024; P$60 -1.024,1.25 | smd 1.1 x 1.59: P$13 0.325,0 | smd 0.3 x 0.5 rotated 315: P$14 -0.592,0.512 | smd 0.5 x 1.59: P$15 -0.27,0 | smd 0.1 x 0.185 rotated 135: P$22 -1.024,-1.25; P$55 1.25,1.024 | smd 0.13 x 0.08: P$27 -0.94,-1.26; P$29 -1.06,-1.32; P$39 0.94,1.26; P$41 1.06,1.32; P$53 0.94,-1.26; P$54 1.06,-1.32; P$63 -0.94,1.26; P$64 -1.06,1.32 | smd 0.1 x 0.185 rotated 315: P$35 1.024,1.25; P$65 -1.25,-1.024
SPH0645LM4H = smd 0.6 x 0.525: 1 -0.9,1.4; 2 -0.9,0.55; 4 0.9,0.55; 5 0.9,1.4; 6 0,1.4 | drill 1.025 pad 1.625: 3 0,-0.71
TC2030-IDC-NL = smd 0.787 x 0.787: 1 -1.27,-0.635; 2 -1.27,0.635; 3 0,-0.635; 4 0,0.635; 5 1.27,-0.635; 6 1.27,0.635 | hole 1.016: -2.54,0; 2.54,1.016; 2.54,-1.016
0603_CAP = smd 0.7 x 1: 1 -0.65,0; 2 0.65,0
SOT23-3 = smd 0.8 x 0.9: 1 -0.95,-1; 2 0.95,-1; 3 0,1.1
0402_RES = smd 0.536 x 0.546: 1 -0.433,0; 2 0.433,0
B3U-1000P = smd 0.8 x 1.7: 1 -1.7,0; 2 1.7,0
SOT-23 = smd 0.787 x 0.889: 1 0.025,-1.016; 2 -0.94,1.016; 3 0.991,1.016
GA1A1S202WP = smd 0.8 x 0.8: 1 -0.9,-0.75; 2 -0.9,0.75; 3 0.9,0.75; 4 0.9,-0.75
SOT95P280X145-5N = smd 1.27 x 0.559: 1 -1.295,0.94; 2 -1.295,0; 3 -1.295,-0.94; 4 1.295,-0.94; 5 1.295,0.94
MICRO-SD-SOCKET-PP = smd 0.8 x 1.5: 1 -8.94,10.7; 2 -7.84,10.3; 3 -6.74,10.7; 4 -5.64,10.9; 5 -4.54,10.7; 6 -3.44,10.9; 7 -2.34,10.7; 8 -1.24,10.7 | smd 1.8 x 1.4: CD1 -7.75,0.4; CD2 -2.05,0.4 | smd 1.4 x 1.9: GND1 -13.6,14.55; GND2 -0.45,13.55
QFN-48-6MM = smd 0.8 x 0.203: 1 -3,2.2; 2 -3,1.8; 3 -3,1.4; 4 -3,1; 5 -3,0.6; 6 -3,0.2; 7 -3,-0.2; 8 -3,-0.6; 9 -3,-1; 10 -3,-1.4; 11 -3,-1.8; 12 -3,-2.2; 25 3,-2.2; 26 3,-1.8; 27 3,-1.4; 28 3,-1; 29 3,-0.6; 30 3,-0.2; 31 3,0.2; 32 3,0.6; 33 3,1; 34 3,1.4; 35 3,1.8; 36 3,2.2 | smd 0.203 x 0.8: 13 -2.2,-3; 14 -1.8,-3; 15 -1.4,-3; 16 -1,-3; 17 -0.6,-3; 18 -0.2,-3; 19 0.2,-3; 20 0.6,-3; 21 1,-3; 22 1.4,-3; 23 1.8,-3; 24 2.2,-3; 37 2.2,3; 38 1.8,3; 39 1.4,3; 40 1,3; 41 0.6,3; 42 0.2,3; 43 -0.2,3; 44 -0.6,3; 45 -1,3; 46 -1.4,3; 47 -1.8,3; 48 -2.2,3 | smd 4.6 x 4.6: GND 0,0
MAX-M8 = smd 1.8 x 0.7: 1 4.75,-4.4; 9 4.75,4.4; 10 -4.75,4.4; 18 -4.75,-4.4 | smd 1.8 x 0.8: 2 4.75,-3.3; 3 4.75,-2.2; 4 4.75,-1.1; 5 4.75,0; 6 4.75,1.1; 7 4.75,2.2; 8 4.75,3.3; 11 -4.75,3.3; 12 -4.75,2.2; 13 -4.75,1.1; 14 -4.75,0; 15 -4.75,-1.1; 16 -4.75,-2.2; 17 -4.75,-3.3
QCS5I = smd 0.35 x 0.425: 1 -0.5,0; 2 0,-0.287; 3 0.5,-0.287; 4 0.5,0.287; 5 0,0.287
LNA-TSLP-6-2-ALT = smd 0.45 x 0.25: 1 -0.3,0.4; 2 -0.3,0; 3 -0.3,-0.4; 4 0.3,-0.4; 5 0.3,0; 6 0.3,0.4
CMB-6544PF = drill 0.5 pad 1.27: P$4 1.5,1.27; P$5 1.5,-1.27
1X18-SMALL-PADS = drill 0.889 pad 1.753: 1 -20.32,0; 2 -17.78,0; 3 -15.24,0; 4 -12.7,0; 5 -10.16,0; 6 -7.62,0; 7 -5.08,0; 8 -2.54,0; 9 0,0; 10 2.54,0; 11 5.08,0; 12 7.62,0; 13 10.16,0; 14 12.7,0; 15 15.24,0; 16 17.78,0; 17 20.32,0; 18 22.86,0
TXC-8Y = smd 0.8 x 0.7: 1 -0.65,-0.5; 2 0.65,-0.5; 3 0.65,0.5; 4 -0.65,0.5
ABS05 = smd 0.5 x 1: A -0.55,0; B 0.55,0

### Placement (x,y rotation side)
1  8.72,2.88 90 bottom
2  41.06,3.54 90 bottom
A2  -18.14,40.68 270 bottom  (outside the outline)
ANT  27.79,56.93 90 bottom
B2  -14.19,43.49 180 top  (outside the outline)
C1  27.62,27.7 180 top
C2  53.73,21.71 0 top
C3  31.87,30.23 0 top
C4  44.9,19.62 180 top
C5  8.23,17.44 270 top
C6  11.92,20.51 0 top
C7  44.9,17.48 0 top
C8  48.76,23.97 0 top
C9  45.4,28.16 0 top
C10  81.45,39.03 270 top  (outside the outline)
C11  23.8,2.7 0 top
C12  -19.8,-29.8 0 top  (outside the outline)
C13  -19.8,-32.7 0 top  (outside the outline)
C14  -19.8,-35.6 0 top  (outside the outline)
C15  -19.8,-38.5 0 top  (outside the outline)
C22  -5.88,47.15 90 top  (outside the outline)
C23  -14.25,41.19 180 top  (outside the outline)
C24  -4.74,41.65 0 top  (outside the outline)
C25  -3.35,42.09 270 top  (outside the outline)
C26  -15.29,38.79 270 top  (outside the outline)
C27  -11.65,37.8 270 top  (outside the outline)
C28  -10.97,39.43 270 top  (outside the outline)
C29  -13.66,45.75 90 top  (outside the outline)
C30  -14.69,44.55 180 top  (outside the outline)
C31  -15.54,42.8 270 top  (outside the outline)
C32  -9.7,39.43 90 top  (outside the outline)
C33  -7.67,39.3 90 top  (outside the outline)
C35  69.27,48.23 180 top  (outside the outline)
C36  69.41,50.82 180 top  (outside the outline)
C39  69.43,32.17 270 top  (outside the outline)
C41  72.58,32.27 180 top  (outside the outline)
C43  69.27,49.5 180 top  (outside the outline)
D2  -5.25,38.03 180 top  (outside the outline)
FIX  76.26,52.86 0 top  (outside the outline)
GND  27.86,31.23 0 top
IC4  8.57,24.65 0 top
J1  43.48,45.95 0 top
L1  48.06,63.37 0 bottom
L4  -3.35,44 90 top  (outside the outline)
L5  -4.62,43.74 270 top  (outside the outline)
L8  74.73,49.62 90 top  (outside the outline)
L9  73.46,49.62 90 top  (outside the outline)
L10  72.08,28.75 270 top  (outside the outline)
Q3  74.24,53.76 270 top  (outside the outline)
R1  15.96,48.59 180 top
R2  15.96,46.28 180 top
R3  63.95,42.53 0 top  (outside the outline)
R4  17.05,15.73 0 top
R5  10.14,20.49 0 top
R6  41.6,20.09 0 top
R7  13.27,2.58 180 top
R8  53.27,18.78 270 top
R9  53.74,23.98 180 top
R10  6.07,20.75 180 top
R11  6.06,18.8 180 top
R12  48.78,21.73 0 top
R13  44.95,23.94 180 top
R14  44.91,21.76 0 top
R15  41.8,1.72 0 top
R16  40.75,33.43 0 top
R17  45.23,51.05 0 top
R18  69.16,59.02 0 top  (outside the outline)
R19  45.39,30.17 180 top
R20  40.49,38.55 0 top
R21  15.95,51.33 180 top
R22  -5.63,39.93 0 top  (outside the outline)
R23  40.79,57.62 0 top
R24  -2.93,46.75 180 top
R25  41.65,18.63 0 top
R26  6.35,17.43 90 top
R27  15.95,53.73 180 top
R28  31.85,31.83 180 top
R29  76.2,50.03 270 top  (outside the outline)
R30  25,5.4 0 top
R31  40.79,27.18 180 top
R32  72.19,49.62 90 top  (outside the outline)
R33  31.6,2.6 0 top
R34  -19.5,-14.6 0 top  (outside the outline)
R35  -19.5,-18.4 0 top  (outside the outline)
R36  -19.5,-22.2 0 top  (outside the outline)
R37  -19.5,-26 0 top  (outside the outline)
S2  41.45,53.05 90 top
T1  41.35,29.93 90 top
T2  70.11,53.44 0 top  (outside the outline)
U1  27.7,2.9 0 top
U3  49.67,18.75 180 top
U4  65.46,45.03 0 bottom  (outside the outline)
U5  -9.7,43.89 180 top  (outside the outline)
U11  71.87,40.56 90 top  (outside the outline)
U13  70.69,31.41 90 top  (outside the outline)
U14  72.08,30.65 270 top  (outside the outline)
U$1  46.45,17 270 bottom
U$4  36.87,25.69 270 top
U$5  19.09,23.15 90 top
U$69  36.02,-0.51 90 top
X3  -13.46,38.51 270 top  (outside the outline)
X4  -8.63,37.6 0 top  (outside the outline)

### Tracks (layer width: path | path; a pad name or v marks a point on that pad's centre or on a via)
3.3V
  Route15 0.254: 118.74,-12.43 73.93,27.66 | 55.39,30.84 55.39,30.46
  Route15 0.61: 34.66,22.68 35.58,23.6 35.83,23.85 35.83,31.27 34.06,33.04 | 33.55,33.04 34.06,33.04 | 34.06,33.04 37.95,33.04 40.66,30.33 54.88,30.33 55.39,30.84 | 55.39,30.46 55.39,27.66 56.66,26.39 72.03,26.39 73.3,27.66 118.74,-12.43 75.46,27.66 120.01,-10.27
  Route15 0.635: 34.5,22.52 35.58,23.6
  pour Route15 (no thermals): 76.35,25.38 76.35,27.16 79.01,27.16 79.01,25.25 76.35,25.25
-AMP  (3 unrouted)
A_MIC_OUT  (2 unrouted)
ANT  (1 unrouted)
AVDD1  (via drill 0.2, 0.35)
  Top 0.203: U5.35 -13.18,42.09 -13.25,41.99 -13.25,41.79 -13.15,41.69 U5.36 -12.7,41.13 v-12.47,40.9 -12.52,40.84 -13.47,40.84 C23.1 | L4.1 C25.1 v-2.52,42.53
  Bottom 0.203: v-12.47,40.9 -11.98,41.46 -7.54,41.46 -6.78,40.7 -3.22,40.7 -2.5,41.42 -2.5,42.53 v-2.52,42.53
D1_LED  (1 unrouted)
D2_LED  (1 unrouted)
D_MIC_BCLK  (1 unrouted)
D_MIC_DATA  (1 unrouted)
D_MIC_WS  (1 unrouted)
DCC1
  Top 0.203: U5.2 -6.02,42.09 -5.25,42.85 -4.68,42.85 L5.2
GND  (via drill 0.2, 0.35)  (76 unrouted)
  Top 0.203: C22.2 -6.22,47.66 -6.6,47.27 -7.11,47.27 U5.13 -7.5,46.23 v-8.17,45.42 | -14.26,42.49 U5.34 -11.47,42.49 v-11.22,42.37 -11.87,42.89 U5.33 | v-8.17,43.39 v-8.17,42.37 | U5.GND v-9.19,43.39
  Top 0.305: B2.GND -14.26,42.49
  other vias: -10.21,43.39 -10.21,44.4 -10.21,45.42 -10.21,42.37 -11.22,43.39 -11.22,44.4 -11.22,45.42 -9.19,45.42 -9.19,44.4 -9.19,42.37 -8.17,44.4 -5,45.6
  pour Top: -15.79,42.75 -12.41,42.75 -12.41,44.35 -15.79,44.35
  pour Route2 (no thermals): 30.5,10.9 30.5,46.97 137.43,46.97 137.43,10.9
  pour Route15 (rank 2, no thermals): 30.5,10.9 141.24,10.9 141.24,46.97 30.5,46.97
  pour Top: 46.95,62.63 57.75,62.63 58.55,67.13 57.15,-0.17 -0.05,0.03 -0.35,62.73
  pour Bottom: 0,62.74 57.85,62.74 57.55,0.23 57.35,-0.47 -0.05,-0.37 -3.65,57.23
GPS_PULSE  (1 unrouted)
GPS_PWR_EN  (1 unrouted)
GPS_RF_IN  (1 unrouted)
GPS_RXD  (1 unrouted)
GPS_SCL  (2 unrouted)
GPS_SDA  (2 unrouted)
GPS_TXD  (1 unrouted)
GPS_VCC  (7 unrouted)
IMU_INT  (1 unrouted)
IMU_SCL  (2 unrouted)
IMU_SDA  (2 unrouted)
LIGHT_ADC  (2 unrouted)
LNA_IN1  (1 unrouted)
LNA_OUT1  (1 unrouted)
N$1  (2 unrouted)
N$2  (1 unrouted)
N$3  (3 unrouted)
N$4  (1 unrouted)
N$5  (1 unrouted)
N$6  (1 unrouted)
N$7  (1 unrouted)
N$8  (1 unrouted)
N$9  (3 unrouted)
N$10  (5 unrouted)
N$11  (2 unrouted)
N$12  (1 unrouted)
N$23  (1 unrouted)
N$24
  Top 0.203: B2.ANT1 -13.61,43.69 U5.31
N$25
  Top 0.203: B2.ANT2 -13.61,43.29 U5.32
N$26  (via drill 0.35)
  Top 0.203: C31.1 -15.61,43.3 v-16.2,43.3
  Top 0.254: C31.1 -14.96,43.24 B2.SE
  Bottom 1.016: v-16.2,43.3 -18.07,43.3 A2.1
N$27
  Top 0.203: L5.1 -3.38,44.39 L4.2
N$28
  Top 0.203: U5.37 -11.9,40.53 -12.11,40.31 -13.63,40.31 -14.02,39.93 -14.02,39.22 X3.1 -14.02,39.22 C26.1
N$29
  Top 0.203: X3.3 -12.36,38.23 C27.1 -11.5,38.39 -11.73,38.62 -11.73,40.19 -11.5,40.42 U5.38
N$30
  Top 0.203: C28.1 -11.09,40.04 -11.1,40.29 U5.39
N$31
  Top 0.203: U5.29 -13.13,44.49 -13.66,45.01 C29.1
N$32
  Top 0.203: D2.A R22.2
N$33  (1 unrouted)
N$42  (1 unrouted)
N$43  (1 unrouted)
N$44  (1 unrouted)
N$45  (1 unrouted)
NRF_A2
  Top 0.203: -8.11,37.7 X4.B | X4.B -8.3,37.81 U5.46 | X4.B -7.67,37.88 C33.1
NRF_A3
  Top 0.203: U5.45 -8.7,38.08 X4.A -9.7,37.99 C32.1
NRF_MISO  (1 unrouted)
NRF_MOSI  (1 unrouted)
NRF_P29
  Top 0.203: D2.C -6.15,37.28 -6.27,37.39 -6.27,38.16 -6.65,38.54 -6.65,40.04 U5.48
NRF_SCK  (1 unrouted)
NRF_SWDCLK  (2 unrouted)
NRF_SWDIO/!RESET  (2 unrouted)
  Top 0.203: U5.23
REGOUT  (1 unrouted)
SAW_OUT1  (1 unrouted)
SD_DET  (2 unrouted)
SD_EN  (2 unrouted)
SD_MISO  (2 unrouted)
SD_MOSI  (1 unrouted)
SD_SCK  (1 unrouted)
SD_SS  (2 unrouted)
V_BCKP  (1 unrouted)
VCC  (14 unrouted)
VCC_A_MIC  (3 unrouted)
VCC_D_MIC  (4 unrouted)
VCC_IMU  (4 unrouted)
VCC_LIGHT  (2 unrouted)
VCC_NRF  (1 unrouted)
  Top 0.203: -6.59,46.09 U5.12 -6.7,46.6 -6.58,46.72 C22.1 -5.85,46.75 R24.2 -3.36,46.16 -1.9,43.7 -1.9,41.6 -2.8,40.6 -4.7,40.6 -5.1,41 -5.1,41.67 | -5.24,41.69 C24.1 -5.1,41.67 | U5.1 -6.1,41.69 | -6.1,41.69 -5.12,41.69 -5.1,41.67 | R22.1 -6.1,39.97 -6.1,41.69
VCC_RF  (5 unrouted)
  Route15 0.321: 123.44,12.21 97.05,22.96 96.41,23.6 96.41,27.79 117.47,10.56 98.95,30.33 102.64,30.33 103.27,30.97 115.43,17.16
VDD_PA1
  Top 0.203: U5.30 -13.35,44.09 -13.8,44.55 C30.1 -14.27,44.49 B2.VCC

### Text on the board
bPlace: 2014/10/08 | Brad / Campbell
tNames: PowerWatch / Rev. 2 / Oct 17 | MIC | RESET | MIC | IMU | GPS 0 OHM | GPS 0 OHM
bNames: N. Klugman / M. Podolsky / J. Taneja